# Altium schematic sheet [2] Power_Budget.SchDoc
size 292 x 193 mm; Scale: 1:1; Author: Vishal Y. Bajaj; Organization: ORGANIZATION; Address1: ADDRESS 1; Address2: ADDRESS 2; Address3: ADDRESS 3; Address4: ADDRESS 4; Revision: -; SheetNumber: 2; SheetTotal: 11; ENG_APP_DATE: --/--/--; DSN_APP_DATE: --/--/--; CHK_APP_DATE: --/--/--; Template: A4
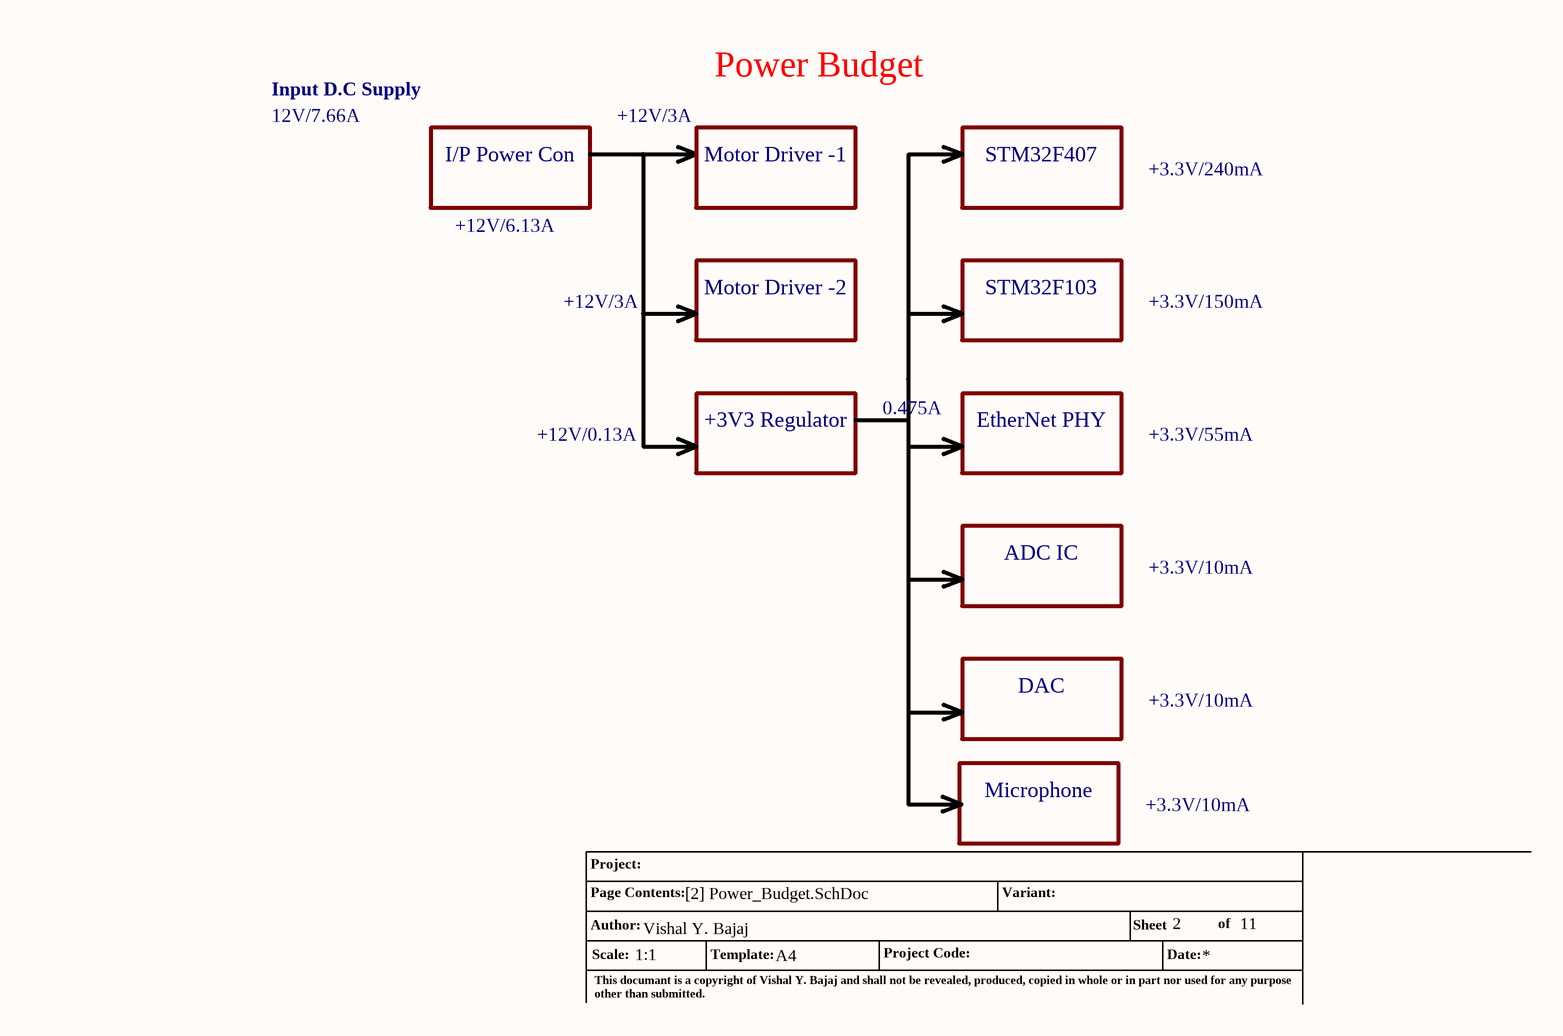
[diagram p0: [2] Power_Budget.SchDoc]

## Notes on the sheet
- Input D.C Supply
- Power Budget
- 12V/7.66A
- I/P Power Con
- +12V/3A
- Motor Driver -1
- STM32F407
- +3.3V/240mA
- +12V/6.13A
- Motor Driver -2
- STM32F103
- +3.3V/150mA
- +12V/0.13A
- +3V3 Regulator
- 0.475A
- EtherNet PHY
- +3.3V/55mA
- ADC IC
- +3.3V/10mA
- DAC
- Microphone
- Project:
- Page Contents:
- Variant:
- Author:
- Scale:
- Template:
- Project Code:
- Sheet
- Date:
- of
- This documant is a copyright of Vishal Y. Bajaj and shall not be revealed, produced, copied in whole or in part nor used for any purpose
  other than submitted.
- DWG. NO.
- REV.
- SHT.
- THIS DOCUMENT AND THE DATA DISCLOSED HEREIN OR HEREWITH IS THE PROPERTY OF ALTIUM LIMITED AND MAY BE FREELY DISTRIBUTED IN WHOLE. NO RIGHTS ARE RESERVED OR EXPRESS OR IMPLIED WARANTEE GIVEN.
- REVISION
- DESCRIPTION
- DATE
- APPROVED
- ENG:
- APPROVALS
- PROJECT
- DSN:
- CHK:
- REFERENCE DOCUMENTS
- PROJECT REVISION:
- TITLE
- DOCUMENT REVISION:
- DESIGN ITEM:
- BOM:
- FAB DWG:
- PCB DWG:
- ASSY DWG:
- SCALE:
- SIZE
- B
- CAGE CODE
- FILE NAME
- DWG NO.
- SHEET
- OF
- REV